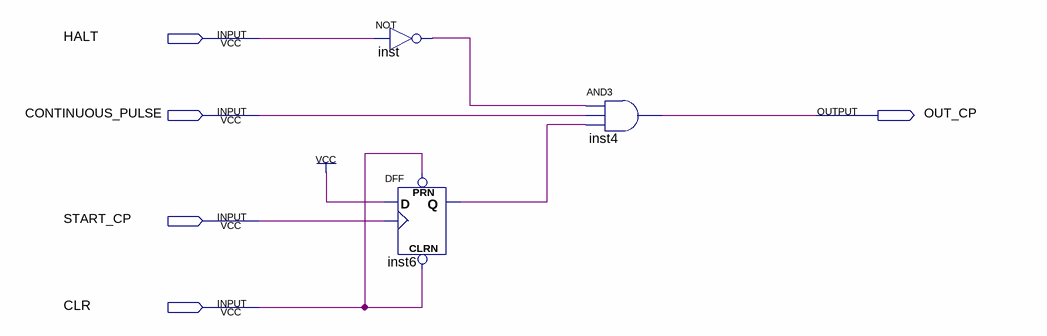
[diagram p0: schematic sheet]
// Quartus schematic START-CP.bdf as structural Verilog: 3 symbols, 5 pins
module \START-CP  (
  input  HALT,
  input  CONTINUOUS_PULSE,
  input  START_CP,
  input  CLR,
  output OUT_CP
);

  wire inst6_q, inst_out;

  not inst (inst_out, HALT);
  DFF inst6 (.CLRN(CLR), .CLK(START_CP), .D(1'b1), .PRN(CLR), .Q(inst6_q));
  and inst4 (OUT_CP, inst_out, CONTINUOUS_PULSE, inst6_q);
endmodule
